# Altium project 01-Suiveur.PrjPcb
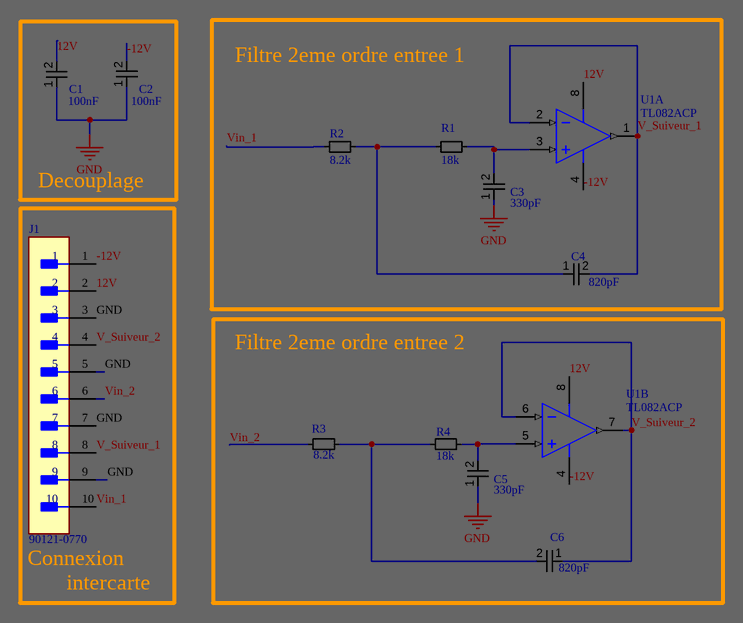
[diagram p0: Suiveur.SchDoc]
CAGE_CODE: ?????; CONTRACT_NUMBER: <CONTRACT NO>; DOC_NO_ASSY_DWG: <ASSY DWG NO>; DOC_NO_BOM: <BOM DOC NO>; DOC_NO_FAB_DWG: <FAB DWG NO>; DOC_NO_SCH_DWG: <SCH DWG NO>; PCB_2_DEC_TOL: +/-.01; PCB_3_DEC_TOL: +/-.010; PCB_ANG_TOL: +/-1/2; PCB_ASSEMBLY_NO: <PCB ASSY NO>; PCB_CHECKER: - -----; PCB_CHECKER_APP_DATE: --/--/----; PCB_DESIGNER: - -----; PCB_DESIGNER_APP_DATE: --/--/----; PCB_DWG_NO: <PCB DWG NO>; PCB_ENGINEER: - -----; PCB_ENGINEER_APP_DATE: --/--/----; PCB_PART_NUMBER: <PCB PN>; PCB_REV: A; SCH_REV: A
1 sheet, 12 parts. Net scope: global (net labels, ports and power ports of the same name join across sheets).
Board file: Suiveur.PcbDoc

## Sheet Suiveur.SchDoc
size 431 x 279 mm; SheetNumber: 1; SheetTotal: 1; ENG_APP_DATE: --/--/--; DSN_APP_DATE: --/--/--; CHK_APP_DATE: --/--/--

### Parts
C1  value 100nF  [Cap_6.0%2A2.5%2A6mm]  (hidden comment: Cap_6.0*2.5*6mm)
C2  value 100nF  [Cap_6.0%2A2.5%2A6mm]  (hidden comment: Cap_6.0*2.5*6mm)
C3  value 330pF  [Cap_6.0%2A2.5%2A6mm]  (hidden comment: Cap_6.0*2.5*6mm)
C4  value 820pF  [Cap_6.0%2A2.5%2A6mm]  (hidden comment: Cap_6.0*2.5*6mm)
C5  value 330pF  [Cap_6.0%2A2.5%2A6mm]  (hidden comment: Cap_6.0*2.5*6mm)
C6  value 820pF  [Cap_6.0%2A2.5%2A6mm]  (hidden comment: Cap_6.0*2.5*6mm)
J1  90121-0770  [FP-90121-0770-MFG]
R1  value 18k  [Res_Axial_3.5x6.5mm_TH]  (hidden comment: Res_3.5x6.5mm_TH)
R2  value 8.2k  [Res_Axial_3.5x6.5mm_TH]  (hidden comment: Res_3.5x6.5mm_TH)
R3  value 8.2k  [Res_Axial_3.5x6.5mm_TH]  (hidden comment: Res_3.5x6.5mm_TH)
R4  value 18k  [Res_Axial_3.5x6.5mm_TH]  (hidden comment: Res_3.5x6.5mm_TH)
U1  TL082ACP  [P0008A]  (parts A,B of 2)

### Blocks framed on the sheet
Decouplage: C1 C2
Filtre 2eme ordre entree 1: C3 C4 R1 R2 U1
Filtre 2eme ordre entree 2: C5 C6 R3 R4 U1

### Nets
GND: C1.1 C2.1 C3.1 C5.1 J1.3 J1.5 J1.7 J1.9
12V: C1.2 J1.2 U1.8(VCC+)
-12V: C2.2 J1.1 U1.4(VCC-)
V_Suiveur_1: C4.2 J1.8 U1.1(OUT1) U1.2(IN1-)
V_Suiveur_2: C6.1 J1.4 U1.6(IN2-) U1.7(OUT2)
Vin_1: J1.10 R2.0
Vin_2: J1.6 R3.0
NetC3_2: C3.2 R1.1 U1.3(IN1+)
NetC4_1: C4.1 R1.0 R2.1
NetC5_2: C5.2 R4.1 U1.5(IN2+)
NetC6_2: C6.2 R3.1 R4.0

### Notes on the sheet
- (near J1) Connexion
- intercarte
- DWG. NO.
- REV.
- SHT.
- THIS DOCUMENT AND THE DATA DISCLOSED HEREIN OR HEREWITH IS THE PROPERTY OF ALTIUM LIMITED AND MAY BE FREELY DISTRIBUTED IN WHOLE. NO RIGHTS ARE RESERVED OR EXPRESS OR IMPLIED WARANTEE GIVEN.
- REVISION
- DESCRIPTION
- DATE
- APPROVED
- ENG:
- APPROVALS
- PROJECT
- DSN:
- CHK:
- REFERENCE DOCUMENTS
- PROJECT REVISION:
- TITLE
- DOCUMENT REVISION:
- DESIGN ITEM:
- BOM:
- FAB DWG:
- PCB DWG:
- ASSY DWG:
- SCALE:
- SIZE
- B
- CAGE CODE
- FILE NAME
- DWG NO.
- SHEET
- OF
- REV

### Library data of the parts
J1 = CMP-04776-001047-1: CONN HEADER R/A 10POS 2.54MM; Voltage Rating: 350V; Current Rating: 3A; Number of Positions: 10; Glow Wire Compliant: Non-compliant; Gender: Male; Number of Circuits: 9; Insulation Resistance: 5GR; Connector Type: Male Pin; Contact Resistance: 20mR; System: Connector; Contact Material: Brass; Voltage Rating (AC): 350V; Housing Material: Polyester; Min Operating Temperature: -55°C; Termination: Solder; Material: Glass; Lead Free: Lead Free; Packaging: Bulk; Pitch: 2.54mm; Mount: Through Hole; Number of Poles: 10; RoHS Compliant: Yes; Working Voltage: 350V; Contact Plating: Gold; Contact Type: Male Pin; Package Quantity: 1; Series: C-Grid III™ 90121; Lead Pitch: 2.54mm; Radiation Hardening: No; Max Operating Temperature: 125°C; Number of Contacts: 10; Housing Color: Black; Orientation: Right Angle; Number of Rows: 1; Color: Black; Contact Mating Length: 0.266inch
U1 = CMP-0017-00991-2: JFET-Input Operational Amplifier, 7 to 36 V, 0 to 70 degC, 8-pin DIP (P8), Pb-Free (RoHS); Manufacturer: Texas Instruments; GBW(Typ)(MHz): 3; Offset Drift(Typ)(uV/C): 18; IIB(Max)(pA): 200; Vio (25C)(Max)(mV): 6; Rating: Catalog; Slew Rate(Typ)(V/us): 13; Iq per channel(Max)(mA): 2.8; Total Supply Voltage(Min)(+5V is 5, +/-5V is 10): 7; CMRR(Min)(dB): 75; Total Supply Voltage(Max)(+5V is 5, +/-5V is 10): 36; Sub Family: General Purpose Amplifier, High Supply Voltage Amplifier (>=30V); Number of Channels: 2; ComponentLink2Description: Datasheet; ComponentLink3Description: Package Specification; ComponentLink1Description: Manufacturer URL; ComponentLink3URL: http://www.ti.com/litv/pdf/mpdi001b; Mounting Technology: Through Hole; Code_JEDEC: MS-001; PartNumber: TL082ACP; PackageVersion: 4040082/E, 04/2010; Eco-Plan: Pb-Free (RoHS); PackageReference: P0008A; PackageDescription: 8-Pin Plastic In-Line, Body 9.59 x 6.35 mm, Pitch 2.54 mm; ComponentLink2URL: http://www.ti.com/lit/ds/symlink/tl082a.pdf; DatasheetVersion: SLOS081G; ComponentLink1URL: http://www.ti.com/; Vn at 1kHz(Typ)(nV/rtHz): 18